# EAGLE design SmartSwitchBoard1x4vert (EAGLE 6.2)
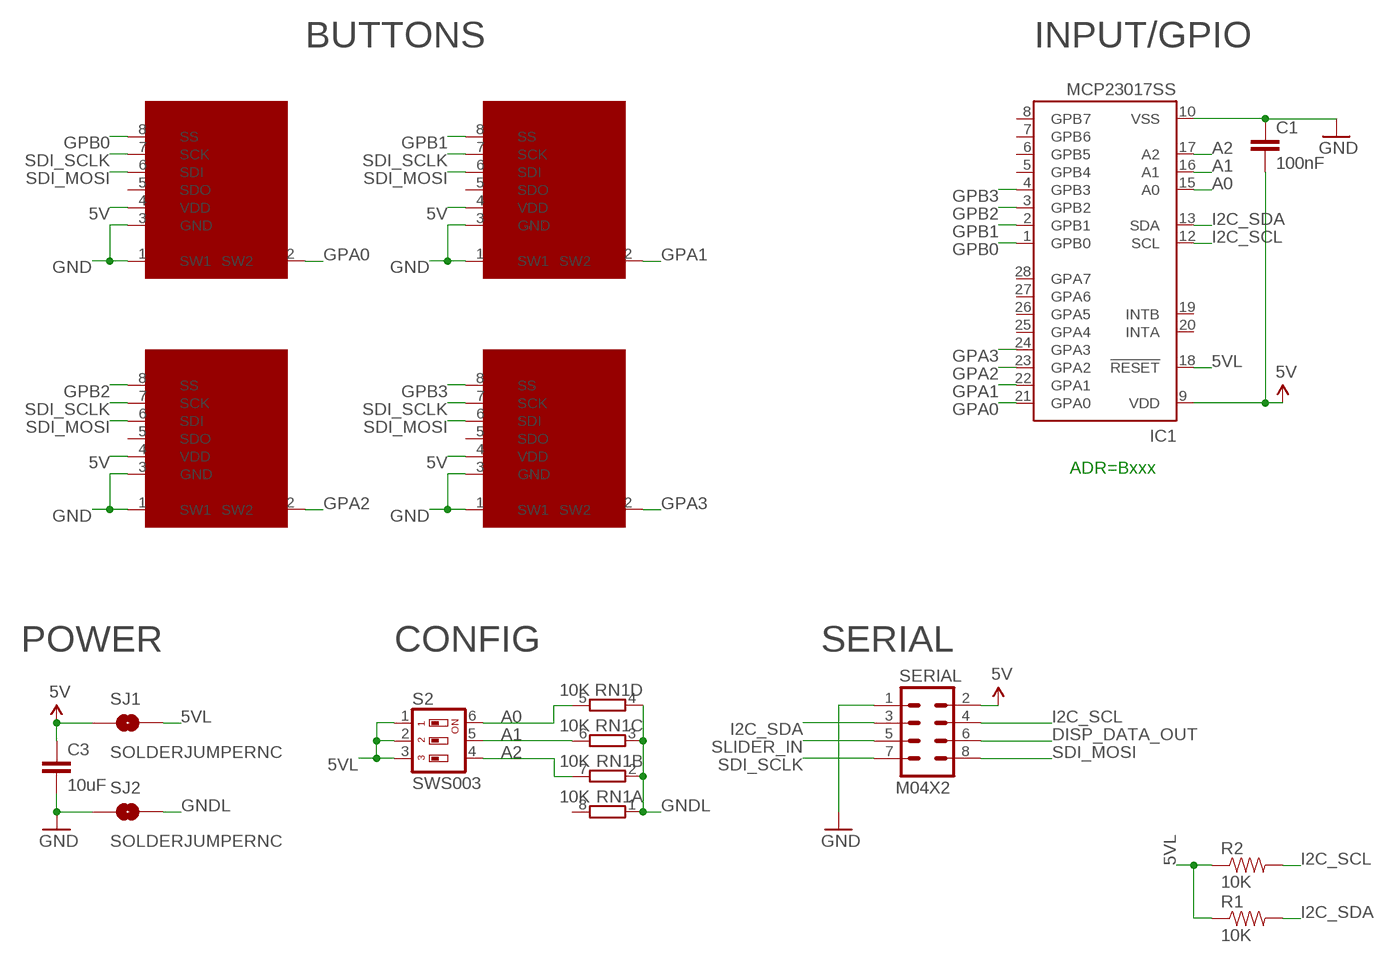
[diagram p0: schematic, sheet 1]

## Parts
C1  100nF  CAP0603-CAP  [0603-CAP]
C3  10uF  CAP0805  [0805]
IC1  MCP23017SS  [SSOP28]
R1  10K  RESISTOR0603-RES  [0603-RES]
R2  10K  RESISTOR0603-RES  [0603-RES]
RN1  10K  4R-NCAY16  [CAY16_HAND]
S2  SWS003  [SMS-003]
SERIAL  M04X2  [2X4]
SJ1  SOLDERJUMPERNC  [SJ_2S]
SJ2  SOLDERJUMPERNC  [SJ_2S]
U$2  SMART_SWITCHSMART_SWITCH_8PIN  [SMART_SWITCH]
U$3  SMART_SWITCHSMART_SWITCH_8PIN  [SMART_SWITCH]
U$4  SMART_SWITCHSMART_SWITCH_8PIN  [SMART_SWITCH]
U$5  SMART_SWITCHSMART_SWITCH_8PIN  [SMART_SWITCH]

## Nets
5V [Power]: C1.2 C3.1 IC1.9(VDD) SERIAL.2 SJ1.1 U$2.4(VDD) U$3.4(VDD) U$4.4(VDD) U$5.4(VDD)
5VL: IC1.18(!RESET) R1.1 R2.1 S2.1 S2.2 S2.3 SJ1.2
A0: IC1.15(A0) RN1.5 S2.6
A1: IC1.16(A1) RN1.6 S2.5
A2: IC1.17(A2) RN1.7 S2.4
DISP_DATA_OUT: SERIAL.6
GND [Power]: C1.1 C3.2 IC1.10(VSS) SERIAL.1 SJ2.1 U$2.1(SW1) U$2.3(GND) U$3.1(SW1) U$3.3(GND) U$4.1(SW1) U$4.3(GND) U$5.1(SW1) U$5.3(GND)
GNDL: RN1.1 RN1.2 RN1.3 RN1.4 SJ2.2
GPA0: IC1.21(GPA0) U$2.2(SW2)
GPA1: IC1.22(GPA1) U$3.2(SW2)
GPA2: IC1.23(GPA2) U$4.2(SW2)
GPA3: IC1.24(GPA3) U$5.2(SW2)
GPB0: IC1.1(GPB0) U$2.8(SS)
GPB1: IC1.2(GPB1) U$3.8(SS)
GPB2: IC1.3(GPB2) U$4.8(SS)
GPB3: IC1.4(GPB3) U$5.8(SS)
I2C_SCL: IC1.12(SCL) R2.2 SERIAL.4
I2C_SDA: IC1.13(SDA) R1.2 SERIAL.3
SDI_MOSI: SERIAL.8 U$2.6(SDI) U$3.6(SDI) U$4.6(SDI) U$5.6(SDI)
SDI_SCLK: SERIAL.7 U$2.7(SCK) U$3.7(SCK) U$4.7(SCK) U$5.7(SCK)
SLIDER_IN: SERIAL.5
Unconnected: IC1.5(GPB4) IC1.6(GPB5) IC1.7(GPB6) IC1.8(GPB7) IC1.19(INTB) IC1.20(INTA) IC1.25(GPA4) IC1.26(GPA5) IC1.27(GPA6) IC1.28(GPA7) RN1.8 U$2.5(SDO) U$3.5(SDO) U$4.5(SDO) U$5.5(SDO)

## Notes on the sheet
- BUTTONS | INPUT/GPIO
- ADR=Bxxx
- POWER | CONFIG | SERIAL

## Library data of the parts
C1 C3 = SparkFun:CAP: Capacitor Standard 0603 ceramic capacitor, and 0.1" leaded capacitor.
IC1 = microchip:MCP23017: http://ww1.microchip.com/downloads/en/DeviceDoc/21952a.pdf Source: http://ww1.microchip.com/downloads/en/DeviceDoc/21952a.pdf; MF: MICROCHIP; MPN: MCP23017-E/SS; OC_FARNELL: 1467674; OC_NEWARK: 31K2960
R1 R2 = SparkFun:RESISTOR: Resistor Basic schematic elements and footprints for 0603, 1206, and PTH resistors.
RN1 = SKAARHOJ:4R-N: Array Chip Resistor Source: RS Component / Phycomp; OC_FARNELL: unknown; OC_NEWARK: unknown
S2 = smd-special:SWS003: SMD Dip Switch 3 pol.
SERIAL = SparkFun:M04X2
SJ1 SJ2 = SparkFun:SOLDERJUMPER: Solder Jumper Standard SMD solder jumper. Used to automate production. Two varients : Normally Open and Normally Closed are the same, but have different paste layers. NC will have a large amount of paste and should jumper during reflow.
U$2-U$5 = SKAARHOJ:SMART_SWITCH: SMARTSWITCH IS15DSBFP4RGB www.nkksmartswitch.com

## Net classes
0 default: width 0.203 mm, drill 0.406 mm, clearance 0.203 mm
1 Power: width 0.406 mm, drill 0.61 mm, clearance 0.203 mm

## Board
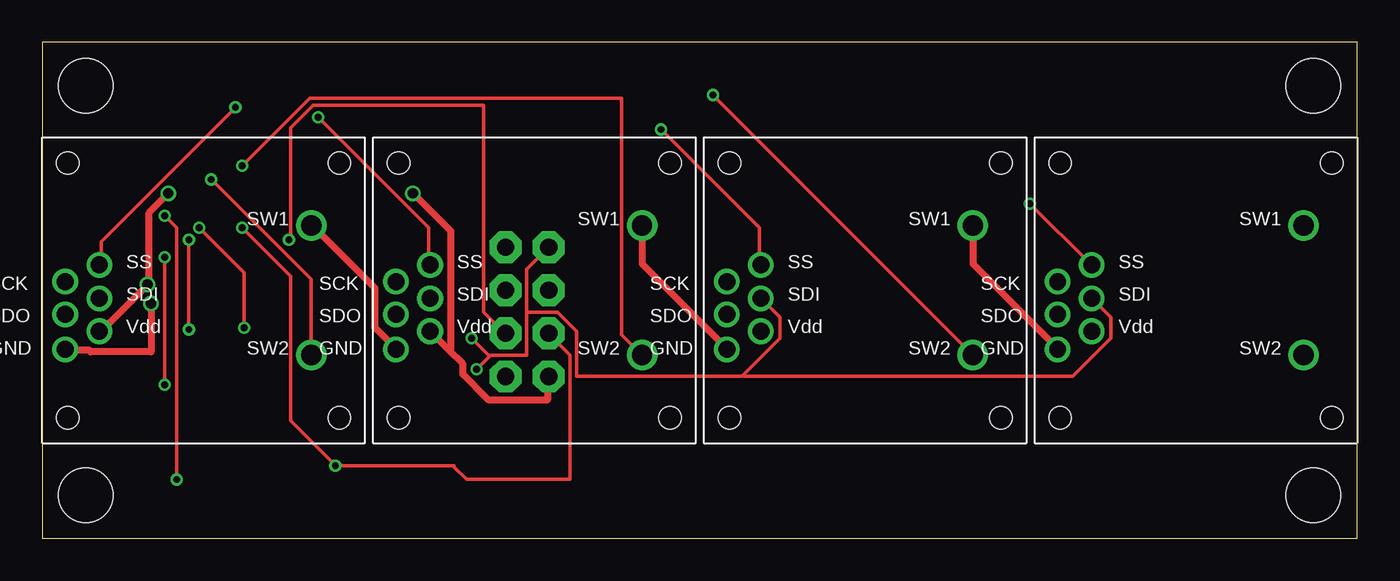
[diagram p1: board, top side]
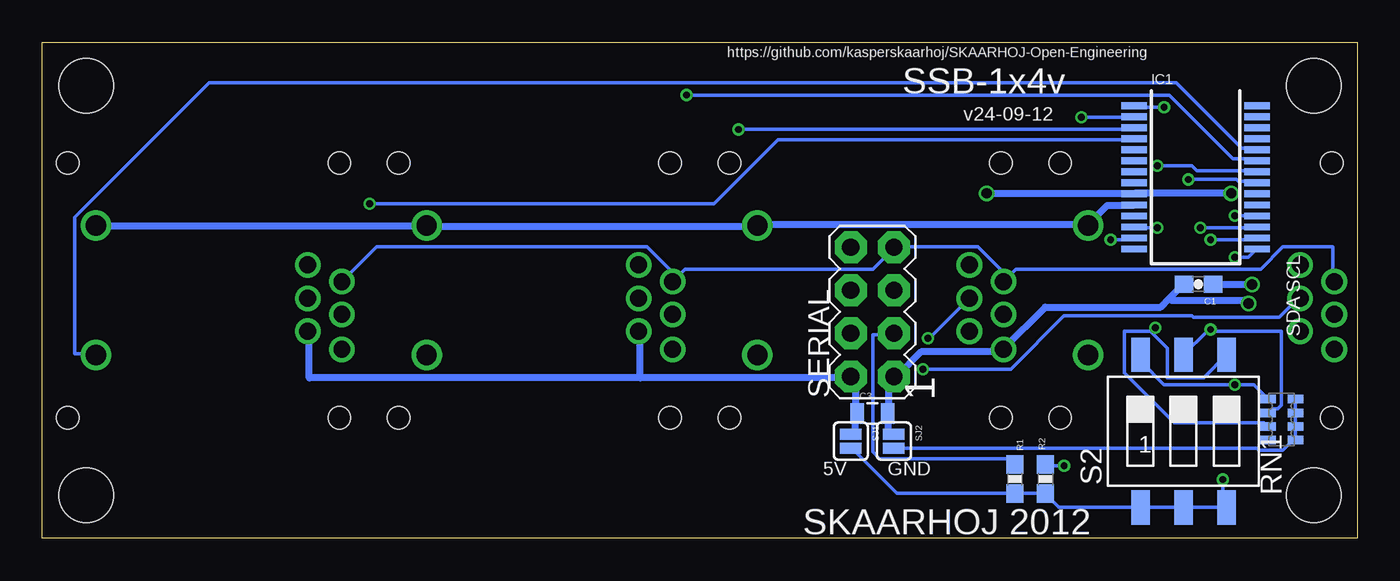
[diagram p2: board, bottom side, seen from below]

Size 77.5 x 29.21 mm. Coordinates in mm from the lower left corner, seen from the top.
Outline: 0,0 77.5,0 77.5,29.21 0,29.21 0,0
Copper layers (1*16): Top 0.035mm / dielectric 1.5mm / Bottom 0.035mm
Design rules: minimum track width 6mil, minimum drill 12mil, track to track 6mil, track to pad 6mil, pad to pad 6mil, via to via 6mil, smd to smd 0mil, copper to edge 10mil, drill to drill 10mil, minimum pad ring 10mil, minimum via ring 6mil, stop-mask expansion 2mil, vias tented up to drill 100mil, thermal gap 10mil
Holes 3.2 mm at 2.54,26.67 2.54,2.54 74.93,2.54 74.93,26.67

### Footprints (pad centres in the part's own frame; a part is rotated, then mirrored left to right if it is on the bottom)
0603-CAP = smd 1.1 x 1: 1 -0.85,0; 2 0.85,0
0805 = smd 0.8 x 1.2: 1 -0.9,0; 2 0.9,0
SSOP28 = smd 0.4 x 1.5: 1 -4.225,-3.625; 2 -3.575,-3.625; 3 -2.925,-3.625; 4 -2.275,-3.625; 5 -1.625,-3.625; 6 -0.975,-3.625; 7 -0.325,-3.625; 8 0.325,-3.625; 9 0.975,-3.625; 10 1.625,-3.625; 11 2.275,-3.625; 12 2.925,-3.625; 13 3.575,-3.625; 14 4.225,-3.625; 15 4.225,3.625; 16 3.575,3.625; 17 2.925,3.625; 18 2.275,3.625; 19 1.625,3.625; 20 0.975,3.625; 21 0.325,3.625; 22 -0.325,3.625; 23 -0.975,3.625; 24 -1.625,3.625; 25 -2.275,3.625; 26 -2.925,3.625; 27 -3.575,3.625; 28 -4.225,3.625
0603-RES = smd 1.1 x 1: 1 -0.85,0; 2 0.85,0
CAY16_HAND = smd 0.5 x 0.904: 1 -1.2,-0.813; 2 -0.4,-0.813; 3 0.4,-0.813; 4 1.2,-0.813; 5 1.2,0.813; 6 0.4,0.813; 7 -0.4,0.813; 8 -1.2,0.813
SMS-003 = smd 1.092 x 2.007: 1 -2.54,-4.496; 2 0,-4.496; 3 2.54,-4.496; 4 2.54,4.496; 5 0,4.496; 6 -2.54,4.496
2X4 = drill 1.016 pad 1.88 octagon: 1 -3.81,-1.27; 2 -3.81,1.27; 3 -1.27,-1.27; 4 -1.27,1.27; 5 1.27,-1.27; 6 1.27,1.27; 7 3.81,-1.27; 8 3.81,1.27
SJ_2S = smd 0.635 x 1.27: 1 -0.412,0; 2 0.412,0
SMART_SWITCH = drill 1.2: 1 6.35,3.81; 2 6.35,-3.81 | drill 1: 3 -8.153,-3.48; 4 -6.147,-2.413; 5 -8.153,-1.422; 6 -6.147,-0.483; 7 -8.153,0.508; 8 -6.147,1.499 | hole 1.3: -8.001,7.506; 8.001,7.506; 8.001,-7.506; -8.001,-7.506

### Placement (x,y rotation side)
C1  9.35,14.96 0 bottom
C3  28.57,7.34 0 bottom
IC1  9.53,21.26 270 bottom
R1  20.17,3.48 90 bottom
R2  18.36,3.48 90 bottom
RN1  4.45,6.99 90 bottom
S2  10.24,6.3 0 bottom
SERIAL  28.57,13.34 90 bottom
SJ1  29.84,5.71 270 bottom
SJ2  27.3,5.71 270 bottom
U$2  9.5,14.61 0 top
U$3  29,14.61 0 top
U$4  48.5,14.61 0 top
U$5  68,14.61 0 top

### Tracks (layer width: path | path; a pad name or v marks a point on that pad's centre or on a via)
5V  (via drill 0.61)
  Top 0.406: U$2.4 3.45,12.19 v6.2,14.94 6.3,15.04 6.3,19.2 v7.42,20.32 | 23.98,11.07 24.79,10.26 24.79,9.65 26.31,8.13 29.77,8.13 29.77,9.45 SERIAL.2 | 23.98,11.07 U$3.4 | v21.84,20.32 24.08,18.09 24.08,11.18 23.98,11.07
  Bottom 0.406: v6.2,14.94 8.43,14.94 C1.2 | v7.42,20.32 13.11,20.32 IC1.9 13.31,20.32 v21.84,20.32 | SJ1.1 29.77,6.2 29.57,6.2 29.57,7.32 C3.1 29.57,7.52 29.57,9.45 29.77,9.45 SERIAL.2 29.97,9.45 42.27,9.45 | 42.27,9.45 42.27,12.19 U$4.4 | 42.27,9.45 61.77,9.45 61.77,12.19 U$5.4
5VL  (via drill 0.41)
  Top 0.203: v7.21,19 7.92,18.29 v7.92,3.45
  Bottom 0.203: SJ1.2 29.77,5.28 27.13,2.64 20.22,2.64 R1.1 20.12,2.64 18.39,2.64 R2.1 18.29,2.54 17.58,1.83 12.8,1.83 S2.1 12.7,1.83 10.26,1.83 S2.2 10.16,1.83 7.92,1.83 | v7.21,19 5.99,19 IC1.18 | 7.92,1.83 v7.92,3.45 | 7.92,1.83 7.72,1.83 S2.3 7.92,1.83
A0  (via drill 0.41)
  Top 0.203: v7.21,9.04 v7.21,16.56
  Bottom 0.203: RN1.5 5.28,8.23 6.1,9.04 v7.21,9.04 11.38,9.04 12.7,10.36 12.7,10.77 S2.6 | v7.21,16.56 6.4,16.56 5.99,16.97 IC1.15
A1  (via drill 0.41)
  Top 0.203: v8.64,12.29 v8.64,17.58
  Bottom 0.203: 8.64,12.19 8.84,12.19 S2.5 | 8.64,12.19 4.47,12.19 4.47,7.82 4.67,7.62 4.98,7.62 5.18,7.42 RN1.6 | v8.64,17.58 6.1,17.58 5.99,17.68 IC1.16 | 8.64,12.19 v8.64,12.29
A2  (via drill 0.41)
  Top 0.203: v9.25,18.29 11.89,15.65 v11.89,12.39
  Bottom 0.203: 12.14,12.14 11.18,11.18 11.18,9.45 9.04,9.45 S2.4 | 12.14,12.14 12.19,12.19 13.72,12.19 13.72,9.75 10.77,6.81 5.49,6.81 5.28,6.6 RN1.7 | v9.25,18.29 5.99,18.29 IC1.17 | 12.14,12.14 v11.89,12.39
GND  (via drill 0.61)
  Top 0.406: v6.4,13.82 6.4,10.97 2.85,10.97 2.74,11.07 1.42,11.07 U$2.3 | U$2.1 15.95,18.39 19.61,14.73 19.61,12.39 20.83,11.18 U$3.3 | U$4.3 40.34,11.18 35.36,16.15 35.36,18.39 U$3.1 | U$5.3 59.84,11.18 54.86,16.15 54.86,18.39 U$4.1
  Bottom 0.406: SJ2.1 27.33,6.2 27.64,6.2 27.64,7.32 C3.2 27.64,7.52 27.64,9.45 27.33,9.45 SERIAL.1 27.13,9.55 25.7,10.97 20.93,10.97 U$3.3 20.83,11.18 18.39,13.61 11.58,13.61 11.07,14.12 | IC1.10 13.21,19.61 14.73,19.61 15.85,18.49 U$2.1 16.05,18.39 16.15,18.49 35.26,18.49 U$3.1 35.36,18.39 54.66,18.39 U$4.1 54.86,18.39 74.27,18.39 U$5.1 | 11.07,14.12 10.26,14.94 C1.1 | v6.4,13.82 6.6,14.02 10.97,14.02 11.07,14.12
GNDL
  Bottom 0.203: RN1.4 3.66,8.13 3.66,7.42 RN1.3 3.66,7.32 3.66,6.6 RN1.2 3.66,6.5 3.66,5.79 RN1.1 3.76,5.79 4.37,5.18 5.79,5.18 5.89,5.28 27.23,5.28 SJ2.2
GPA0  (via drill 0.41)
  Top 0.203: v9.96,21.13 15.85,15.24 15.85,10.87 U$2.2
  Bottom 0.203: v9.96,21.13 7.11,21.13 7.01,21.03 5.99,21.03 IC1.21
GPA1  (via drill 0.41)
  Top 0.203: v11.79,21.95 15.75,25.91 34.14,25.91 34.14,11.99 35.26,10.87 U$3.2
  Bottom 0.203: v11.79,21.95 9.75,21.95 9.45,21.64 5.99,21.64 IC1.22
GPA2  (via drill 0.41)
  Top 0.203: v39.52,26.11 54.76,10.87 U$4.2
  Bottom 0.203: v39.52,26.11 11.07,26.11 7.32,22.35 6.1,22.35 5.99,22.25 IC1.23
GPA3
  Bottom 0.203: IC1.24 5.99,22.96 6.81,22.96 10.67,26.82 67.67,26.82 75.59,18.9 75.59,10.87 74.37,10.87 U$5.2
GPB0  (via drill 0.41)
  Top 0.203: v11.38,25.4 3.45,17.48 3.45,16.15 U$2.8
  Bottom 0.203: v11.38,25.4 13.11,25.4 IC1.1
GPB1  (via drill 0.41)
  Top 0.203: v16.26,24.79 22.76,18.29 22.76,16.15 U$3.8
  Bottom 0.203: v16.26,24.79 13.21,24.79 IC1.2
GPB2  (via drill 0.41)
  Top 0.203: v36.47,24.08 42.27,18.29 42.27,16.15 U$4.8
  Bottom 0.203: v36.47,24.08 13.31,24.08 13.21,24.18 IC1.3
GPB3  (via drill 0.41)
  Top 0.203: v58.22,19.71 61.77,16.15 U$5.8
  Bottom 0.203: v58.22,19.71 37.9,19.71 34.14,23.47 13.21,23.47 IC1.4
I2C_SCL  (via drill 0.41)
  Top 0.203: SERIAL.4 29.87,11.99 31.09,10.77 31.09,3.45 24.99,3.45 24.28,4.17 24.28,4.27 v17.27,4.27 14.63,6.91 14.63,15.44 v11.79,18.29
  Bottom 0.203: v17.27,4.27 18.29,4.27 R2.2 | v11.79,18.29 13.11,18.29 IC1.12
I2C_SDA  (via drill 0.41)
  Top 0.203: v14.53,17.58 14.63,17.68 14.63,24.18 15.95,25.5 26.01,25.5 26.01,13.31 27.23,12.09 SERIAL.3
  Bottom 0.203: R1.2 20.22,4.37 20.52,4.67 28.14,4.67 28.55,5.08 28.55,11.99 27.33,11.99 SERIAL.3 | v14.53,17.58 13.31,17.58 13.21,17.68 IC1.13
SDI_MOSI  (via drill 0.41)
  Top 0.203: 26.36,10.72 26.42,10.77 28.55,10.77 28.55,13.31 | 26.36,10.72 v25.6,9.96 | 28.55,13.31 28.55,15.85 SERIAL.8 | 26.36,10.72 v25.3,11.79 | 41.3,9.6 41.25,9.55 31.5,9.55 31.5,12.19 30.38,13.31 28.55,13.31 | 41.3,9.6 43.48,11.79 43.48,13.01 42.37,14.12 U$4.6 | U$5.6 61.87,14.12 62.99,13.01 62.99,11.79 60.76,9.55 41.35,9.55 41.3,9.6
  Bottom 0.203: v25.6,9.96 20.42,9.96 17.27,13.11 9.75,13.11 9.65,13.01 4.57,13.01 3.45,14.12 U$2.6 | v25.3,11.79 25.2,11.79 U$3.6
SDI_SCLK
  Bottom 0.203: U$2.7 1.42,15.14 1.42,17.17 4.37,17.17 5.69,15.85 20.12,15.85 20.83,15.14 U$3.7 20.62,15.44 22.35,17.17 27.23,17.17 SERIAL.7 27.33,17.07 28.55,15.85 39.62,15.85 40.34,15.14 U$4.7 40.13,15.44 41.86,17.17 57.81,17.17 59.84,15.14 U$5.7

### Text on the board
_bsilk: https://github.com/kasperskaarhoj/SKAARHOJ-Open-Engineering | SSB-1x4v | v24-09-12 | SCL | SDA | 1 | GND | 5V | SKAARHOJ 2012